# EasyEDA Pro project ProPrj_FK407M3-VET6-V1.1-LCD-EB_2024-11-07.epro

# Schematic Schematic1
Board Name: Board1; Create Date: 2024-10-30; Page Name: P1; Project Name: FK407M3-VET6-V1.1-LCD-EB; Schematic Name: Schematic1; Update Date: 2024-10-31; Company: 华北理工大学; Drawed: nayo; Page Size: A4; Reviewed: nayo; Version: V1.0
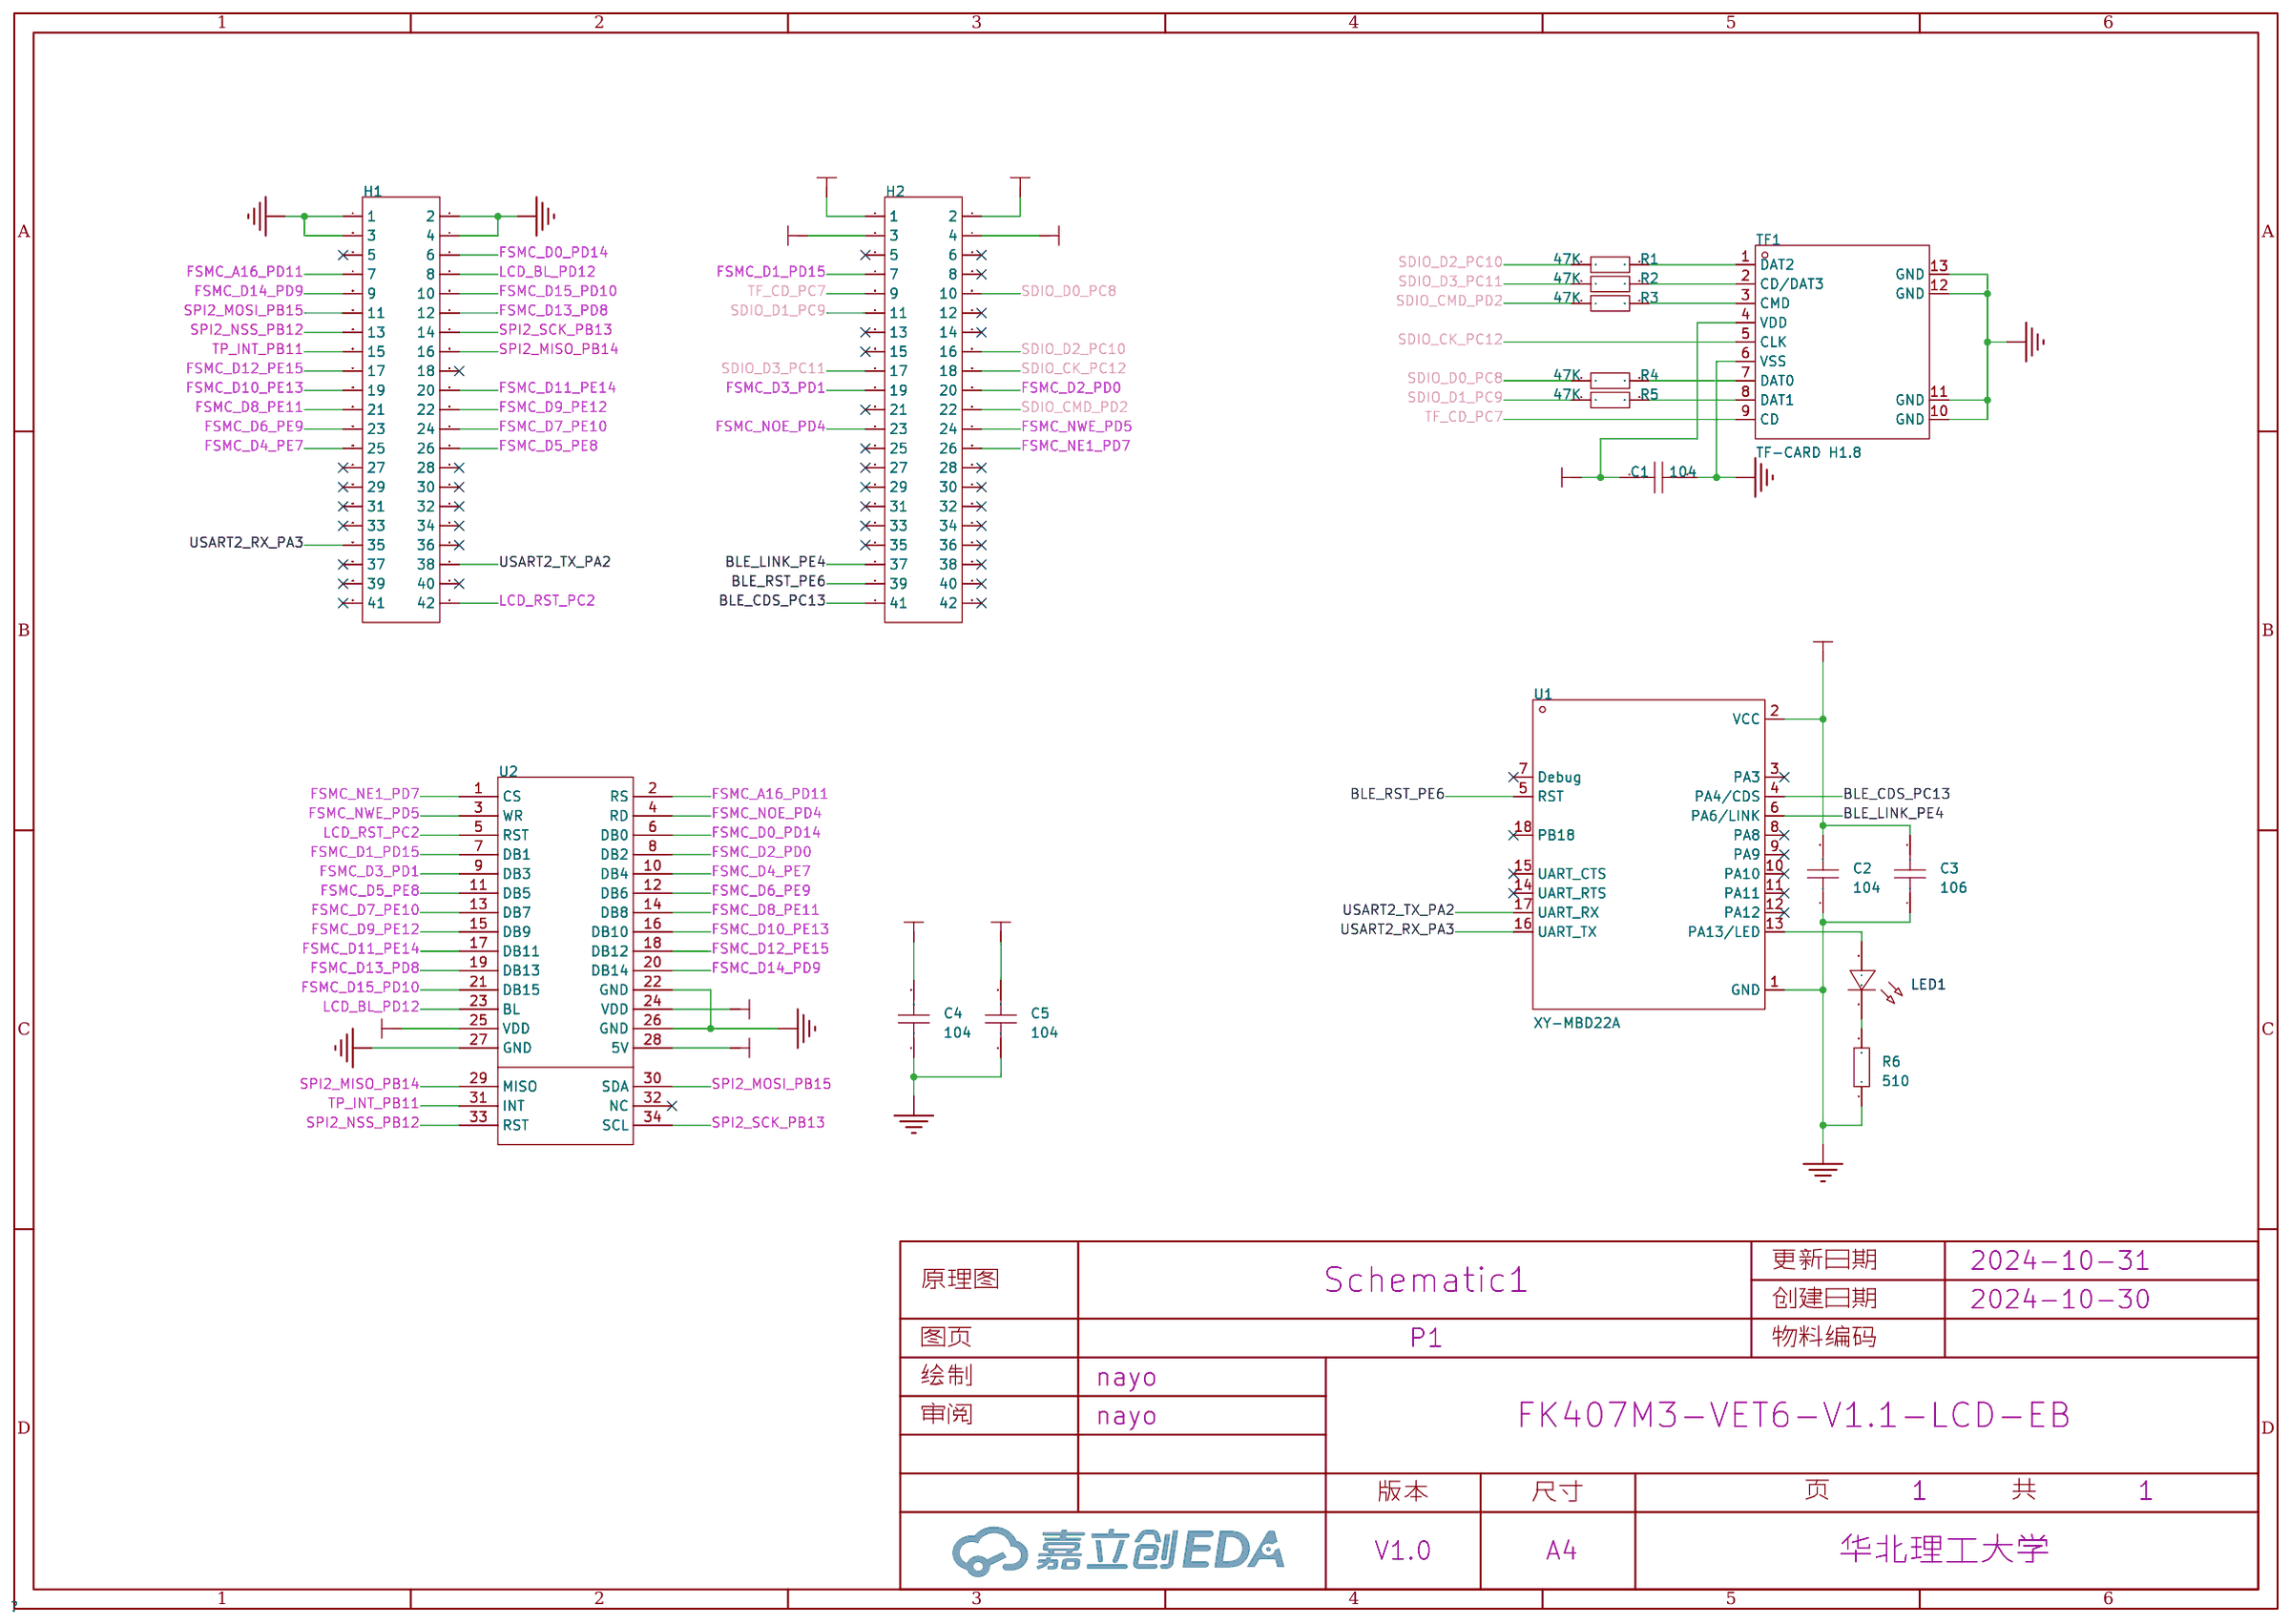
[diagram p0: schematic sheet]

## Parts
C1  104  [C0603]
C2  104  [C0603]
C3  106  [C0603]
C4  104  [C0603]
C5  104  [C0603]
H1  -  [HDR-F_2.54_2x21P]
H2  -  [HDR-F_2.54_2x21P]
LED1  -  [LED_0603]
R1  47K  [R0603]
R2  47K  [R0603]
R3  47K  [R0603]
R4  47K  [R0603]
R5  47K  [R0603]
R6  510  [R0603]
TF1  TF-CARD H1.8  [TF-SMD_TF-CARD-H1.8]
U1  XY-MBD22A  [wirelm-smd_xy-mbd22a]
U2  -  [耀元鸿3.5寸TFT液晶显示屏并口串口电阻屏5点电容屏GT911彩屏LCD-加上挖槽]

## Library data of the parts
C1-C5 = CAP_0603: Supplier Footprint: 0603
H1 H2 = HDR-F_2.54_2x21P
LED1 = LED_0603-B: Supplier Footprint: 0603
R1-R6 = Res_0603: Supplier Footprint: 0603
TF1 = TF-CARD H1.8: 卡连接方式:自弹式;卡类型:MicroSD卡(TF卡);连接器类型:卡座;本体最大高度:1.8mm;触头材质:铜合金;触头镀层:金;工作温度范围:-40℃~+70℃;; LCSC Part Name: 自弹式 MicroSD卡(TF卡) 卡座; Supplier Part: C7529389; Manufacturer: SHOU HAN(首韩); Supplier Footprint: SMD; JLCPCB Part Class: 扩展库; Datasheet: https://atta.szlcsc.com/upload/public/pdf/source/20230818/611DB5E7B45C91025B0B37F957961A64.pdf; Supplier: LCSC; Card Connection Mode: 自弹式; Card Type: MicroSD卡(TF卡); Connector Type: 卡座; Maximum Body Height: 1.8mm; Contact Material: 铜合金; Contact Plating: 金; Operating Temperature Range: -40℃~+70℃
U1 = XY-MBD22A: Supplier Part: C9900138357; Supplier Footprint: 邮票孔; Supplier: LCSC
U2 = 耀元鸿3.5寸TFT液晶显示屏并口串口电阻屏5点电容屏GT911彩屏LCD

## Nets
3V3: C1.1 C2.2 C3.2 C5.2 H2.3 H2.4 TF1.4(VDD) U1.2(VCC) U2.24(VDD) U2.25(VDD)
5V: C4.2 H2.1 H2.2 U2.28(5V)
GND: C1.2 C2.1 C3.1 C4.1 C5.1 H1.1 H1.2 H1.3 H1.4 R6.1 TF1.6(VSS) TF1.10(GND) TF1.11(GND) TF1.12(GND) TF1.13(GND) U1.1(GND) U2.22(GND) U2.26(GND) U2.27(GND)
BLE_CDS_PC13: H2.41 U1.4(PA4/CDS)
BLE_LINK_PE4: H2.37 U1.6(PA6/LINK)
BLE_RST_PE6: H2.39 U1.5(RST)
FSMC_A16_PD11: H1.7 U2.2(RS)
FSMC_D0_PD14: H1.6 U2.6(DB0)
FSMC_D1_PD15: H2.7 U2.7(DB1)
FSMC_D2_PD0: H2.20 U2.8(DB2)
FSMC_D3_PD1: H2.19 U2.9(DB3)
FSMC_D4_PE7: H1.25 U2.10(DB4)
FSMC_D5_PE8: H1.26 U2.11(DB5)
FSMC_D6_PE9: H1.23 U2.12(DB6)
FSMC_D7_PE10: H1.24 U2.13(DB7)
FSMC_D8_PE11: H1.21 U2.14(DB8)
FSMC_D9_PE12: H1.22 U2.15(DB9)
FSMC_D10_PE13: H1.19 U2.16(DB10)
FSMC_D11_PE14: H1.20 U2.17(DB11)
FSMC_D12_PE15: H1.17 U2.18(DB12)
FSMC_D13_PD8: H1.12 U2.19(DB13)
FSMC_D14_PD9: H1.9 U2.20(DB14)
FSMC_D15_PD10: H1.10 U2.21(DB15)
FSMC_NE1_PD7: H2.26 U2.1(CS)
FSMC_NOE_PD4: H2.23 U2.4(RD)
FSMC_NWE_PD5: H2.24 U2.3(WR)
LCD_BL_PD12: H1.8 U2.23(BL)
LCD_RST_PC2: H1.42 U2.5(RST)
SDIO_CK_PC12: H2.18 TF1.5(CLK)
SDIO_CMD_PD2: H2.22 R3.1
SDIO_D0_PC8: H2.10 R4.1
SDIO_D1_PC9: H2.11 R5.1
SDIO_D2_PC10: H2.16 R1.1
SDIO_D3_PC11: H2.17 R2.1
SPI2_MISO_PB14: H1.16 U2.29(MISO)
SPI2_MOSI_PB15: H1.11 U2.30(SDA)
SPI2_NSS_PB12: H1.13 U2.33(RST)
SPI2_SCK_PB13: H1.14 U2.34(SCL)
TF_CD_PC7: H2.9 TF1.9(CD)
TP_INT_PB11: H1.15 U2.31(INT)
USART2_RX_PA3: H1.35 U1.16(UART_TX)
USART2_TX_PA2: H1.38 U1.17(UART_RX)
$1N3517: R5.2 TF1.8(DAT1)
$1N3521: R4.2 TF1.7(DAT0)
$1N3530: R3.2 TF1.3(CMD)
$1N3535: R2.2 TF1.2(CD/DAT3)
$1N3540: R1.2 TF1.1(DAT2)
$1N3834: LED1.2(A) U1.13(PA13/LED)
$1N3899: LED1.1(C) R6.2

Not connected (* = marked no-connect by the designer): H1 5* 18* 27* 28* 29* 30* 31* 32* 33* 34* 36* 37* 39* 40* 41*; H2 5* 6* 8* 12* 13* 14* 15* 21* 25* 27* 28* 29* 30* 31* 32* 33* 34* 35* 36* 38* 40* 42*; U1 3(PA3)* 7(Debug)* 8(PA8)* 9(PA9)* 10(PA10)* 11(PA11)* 12(PA12)* 14(UART_RTS)* 15(UART_CTS)* 18(PB18)*; U2 32(NC)*

# Board PCB1
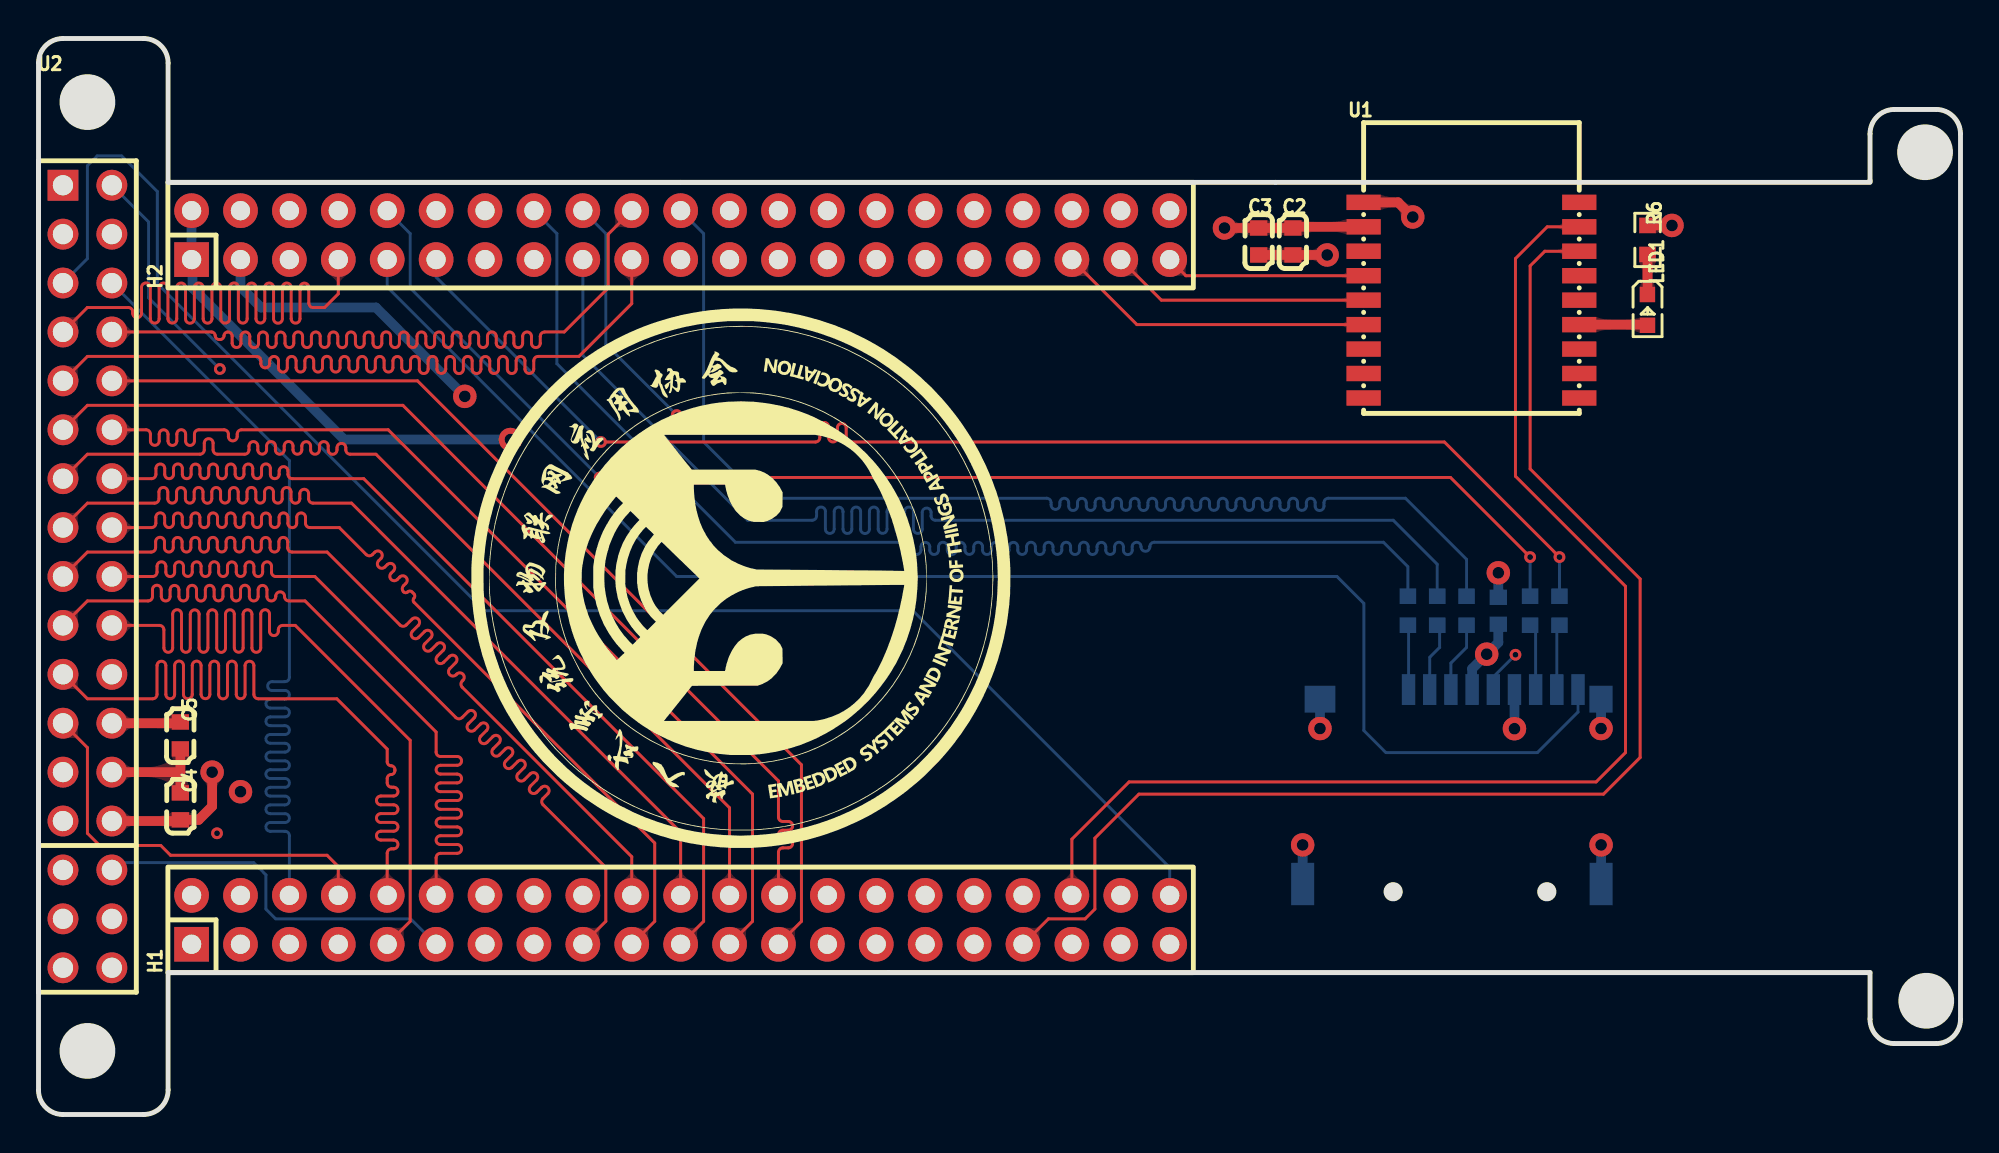
[diagram p1: board, top side]
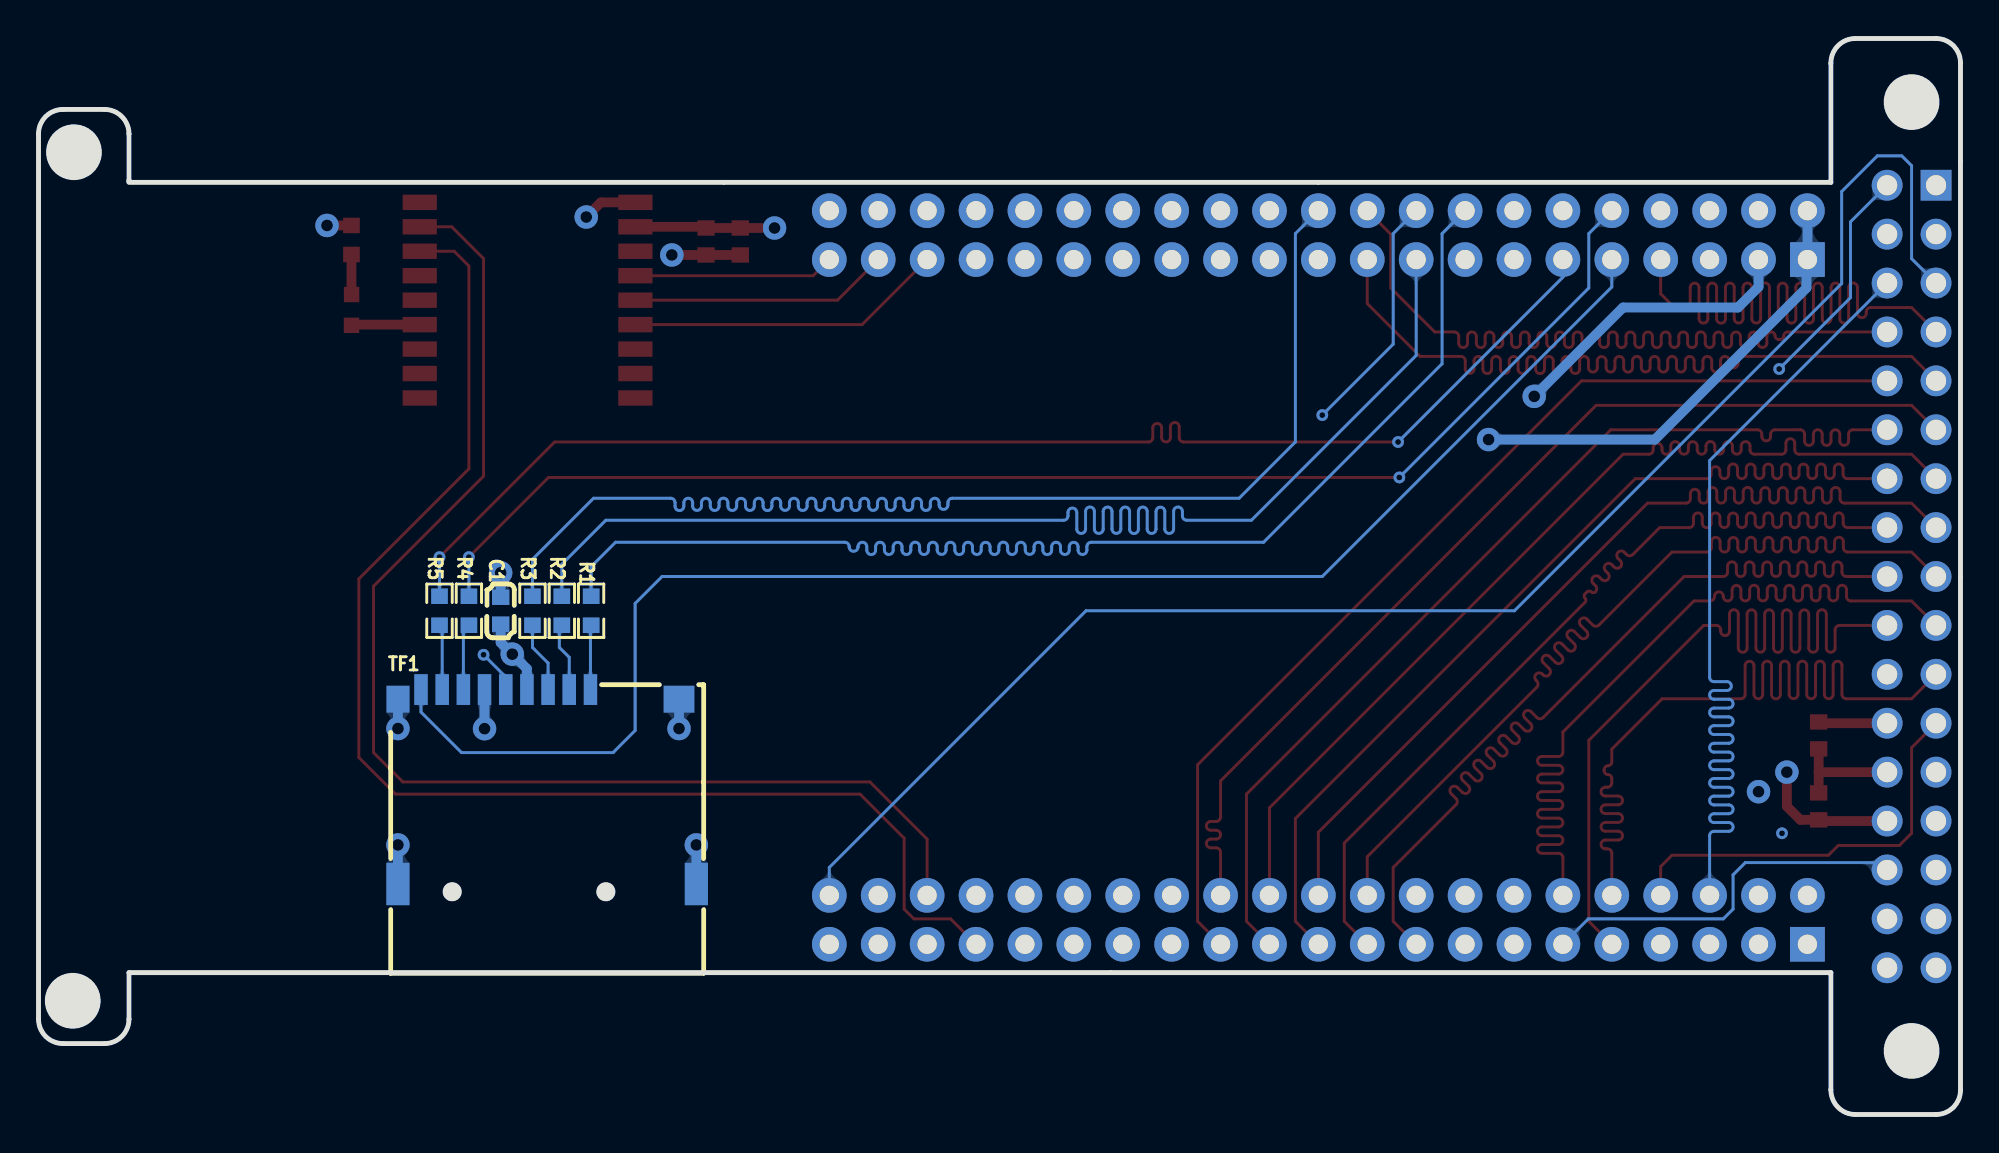
[diagram p2: board, bottom side, seen from below]

Outline 99.82 x 55.88 mm; copper layers: Top Layer, Inner1, Inner2, Bottom Layer. Coordinates in mm from the lower left corner of the outline.
Outline path: 95.12,48.51 95.12,48.46 95.12,50.93 arc(95.49,51.83) 96.39,52.2 98.55,52.2 arc(99.45,51.83) 99.82,50.93 99.82,4.95 arc(99.45,4.05) 98.55,3.68 96.39,3.68 arc(95.49,4.05) 95.12,4.95 95.12,7.37 6.73,7.37 6.73,1.27 arc(6.36,0.37) 5.46,0 1.27,0 arc(0.37,0.37) 0,1.27 0,54.61 arc(0.37,55.51) 1.27,55.88 5.46,55.88 arc(6.36,55.51) 6.73,54.61 6.73,48.41 95.12,48.41
Stack: Top Layer 0.035mm 外层铜厚1oz / Dielectric1 0.2104mm 7628 RC49% 8.6mil / Inner1 0.0152mm 内层铜厚 / Dielectric2 1.065mm 1.1mm H/HOZ Copper / Inner2 0.0152mm 内层铜厚 / Dielectric3 0.2104mm 7628 RC49% 8.6mil / Bottom Layer 0.035mm 外层铜厚1oz

## Design rules (mm)
template: 自定义配置
spacing copperThickness1oz (default): track to track 0.102, other pairs 0.152 to 0.3
spacing copperThickness2oz: track to track 0.203, other pairs 0.152 to 0.3
spacing 高速信号线: track to track 0.305, other pairs 0.152 to 0.3
track width copperThickness1oz (default): min 0.127, default 0.254, max 2.54
track width copperThickness2oz: min 0.203, default 0.254, max 2.54
differential pair differentialPair (default): width min 0.127, default 0.254, max 2.54; gap min 0.152, default 0.152
via viaSize (default): diameter min 0.5, default 0.61, max 10; hole min 0.3, default 0.305, max 6.299
net FSMC_D0_PD14 uses FSMC, 高速信号线
net FSMC_D1_PD15 uses FSMC, 高速信号线
net FSMC_D3_PD1 uses FSMC, 高速信号线
net FSMC_D2_PD0 uses FSMC, 高速信号线
net FSMC_NOE_PD4 uses FSMC, 高速信号线
net FSMC_NWE_PD5 uses FSMC, 高速信号线
net FSMC_NE1_PD7 uses FSMC, 高速信号线
net FSMC_A16_PD11 uses FSMC, 高速信号线
net FSMC_D14_PD9 uses FSMC, 高速信号线
net FSMC_D15_PD10 uses FSMC, 高速信号线
net FSMC_D13_PD8 uses FSMC, 高速信号线
net FSMC_D12_PE15 uses FSMC, 高速信号线
net FSMC_D10_PE13 uses FSMC, 高速信号线
net FSMC_D11_PE14 uses FSMC, 高速信号线
net FSMC_D8_PE11 uses FSMC, 高速信号线
net FSMC_D9_PE12 uses FSMC, 高速信号线
net FSMC_D6_PE9 uses FSMC, 高速信号线
net FSMC_D7_PE10 uses FSMC, 高速信号线
net FSMC_D4_PE7 uses FSMC, 高速信号线
net FSMC_D5_PE8 uses FSMC, 高速信号线
net SDIO_D0_PC8 uses SDIO, 高速信号线
net SDIO_D1_PC9 uses SDIO, 高速信号线
net SDIO_D2_PC10 uses SDIO, 高速信号线
net SDIO_D3_PC11 uses SDIO, 高速信号线
net SDIO_CK_PC12 uses SDIO, 高速信号线
net SDIO_CMD_PD2 uses SDIO, 高速信号线
eq len grp FSMC uses FSMC
eq len grp SDIO uses SDIO

## Placement (name value [footprint] x y rotation side)
C1  104  [C0603]  75.82 26.16 90 bottom
C2  104  [C0603]  65.15 45.34 90 top
C3  106  [C0603]  63.37 45.34 90 top
C4  104  [C0603]  7.37 16 270 top
C5  104  [C0603]  7.37 19.69 90 top
H1  -  [HDR-F_2.54_2x21P]  9.22 10.11 90 top
H2  -  [HDR-F_2.54_2x21P]  9.22 45.67 90 top
LED1  -  [LED_0603]  83.57 41.74 270 top
R1  47K  [R0603]  71.12 26.16 270 bottom
R2  47K  [R0603]  72.64 26.16 270 bottom
R3  47K  [R0603]  74.17 26.16 270 bottom
R4  47K  [R0603]  77.47 26.16 270 bottom
R5  47K  [R0603]  78.99 26.16 270 bottom
R6  510  [R0603]  83.57 45.42 270 top
TF1  TF-CARD H1.8  [TF-SMD_TF-CARD-H1.8]  73.41 17.02 180 bottom
U1  XY-MBD22A  [wirelm-smd_xy-mbd22a]  74.42 42.29 0 top
U2  -  [耀元鸿3.5寸TFT液晶显示屏并口串口电阻屏5点电容屏GT911彩屏LCD-加上挖槽]  0 49.53 0 top

## Footprints (pads in the part's own frame, mm; a bottom-side part is the same pattern mirrored in y, then rotated)
C0603
  rect 0.8x0.9 smd: 1(-0.7,0) 2(0.7,0)
HDR-F_2.54_2x21P
  rect 1.8x1.8 hole 1: 1(-1.27,1.27)
  round 1.8 hole 1: 2(1.27,1.27) 3(-1.27,-1.27) 4(1.27,-1.27) 5(-1.27,-3.811) 6(1.27,-3.811) 7(-1.27,-6.351) 8(1.27,-6.351) 9(-1.27,-8.89) 10(1.27,-8.89) 11(-1.27,-11.431) 12(1.27,-11.431) 13(-1.27,-13.97) 14(1.27,-13.97) 15(-1.27,-16.511) 16(1.27,-16.511) 17(-1.27,-19.05) 18(1.27,-19.05) 19(-1.27,-21.59) 20(1.27,-21.59) 21(-1.27,-24.131) 22(1.27,-24.131) 23(-1.27,-26.671) 24(1.27,-26.671) 25(-1.27,-29.21) 26(1.27,-29.21) 27(-1.27,-31.75) 28(1.27,-31.75) 29(-1.27,-34.291) 30(1.27,-34.291) 31(-1.27,-36.831) 32(1.27,-36.831) 33(-1.27,-39.37) 34(1.27,-39.37) 35(-1.27,-41.91) 36(1.27,-41.91) 37(-1.27,-44.45) 38(1.27,-44.45) 39(-1.27,-46.99) 40(1.27,-46.99) 41(-1.27,-49.531) 42(1.27,-49.531)
LED_0603
  rect 0.8x0.8 smd: 1(-0.851,-0.01) 2(0.75,-0.005)
R0603
  rect 0.806x0.864 smd: 1(-0.753,0) 2(0.753,0)
TF-SMD_TF-CARD-H1.8
  rect 0.7x1.6 smd: 1(2.25,5.05) 2(1.15,5.05) 3(0.05,5.05) 4(-1.05,5.05) 5(-2.15,5.05) 6(-3.25,5.05) 7(-4.35,5.05) 8(-5.45,5.05) 9(-6.55,5.05)
  rect 1.2x1.4 smd: 10(-7.747,4.55)
  rect 1.2x2.2 smd: 11(-7.75,-5.05) 12(7.75,-5.05)
  rect 1.6x1.4 smd: 13(6.85,4.55)
wirelm-smd_xy-mbd22a
  rect 1.778x0.8 smd: 1(-5.6,5.08) 2(-5.6,3.81) 3(-5.6,2.54) 4(-5.6,1.27) 5(-5.6,0) 6(-5.6,-1.27) 7(-5.6,-2.54) 8(-5.6,-3.81) 9(-5.6,-5.08) 10(5.6,-5.08) 11(5.6,-3.81) 12(5.6,-2.54) 13(5.6,-1.27) 14(5.6,0) 15(5.6,1.27) 16(5.6,2.54) 17(5.6,3.81) 18(5.6,5.08)
耀元鸿3.5寸TFT液晶显示屏并口串口电阻屏5点电容屏GT911彩屏LCD-加上挖槽
  rect 1.6x1.6 hole 1.05: 1(1.27,-1.27)
  round 1.6 hole 1.05: 2(3.81,-1.27) 3(1.27,-3.81) 4(3.81,-3.81) 5(1.27,-6.35) 6(3.81,-6.35) 7(1.27,-8.89) 8(3.81,-8.89) 9(1.27,-11.43) 10(3.81,-11.43) 11(1.27,-13.97) 12(3.81,-13.97) 13(1.27,-16.51) 14(3.81,-16.51) 15(1.27,-19.05) 16(3.81,-19.05) 17(1.27,-21.59) 18(3.81,-21.59) 19(1.27,-24.13) 20(3.81,-24.13) 21(1.27,-26.67) 22(3.81,-26.67) 23(1.27,-29.21) 24(3.81,-29.21) 25(1.27,-31.75) 26(3.81,-31.75) 27(1.27,-34.29) 28(3.81,-34.29) 29(1.27,-36.83) 30(3.81,-36.83) 31(1.27,-39.37) 32(3.81,-39.37) 33(1.27,-41.91) 34(3.81,-41.91)

## Nets
As in the schematic.

Pads without a net: H1 5 18 27 28 29 30 31 32 33 34 36 37 39 40 41; H2 5 6 8 12 13 14 15 21 25 27 28 29 30 31 32 33 34 35 36 38 40 42; U1 3 7 8 9 10 11 12 14 15 18; U2 32

## Via types
v1: diameter 1.219, hole 0.61, Top Layer to Bottom Layer, 15 vias
v2: diameter 0.61, hole 0.305, Top Layer to Bottom Layer, 8 vias

## Routing (per net, layer and track width the routed paths; a pad name or vN(x,y) marks a point on that pad's centre or on a via; arc(x,y) is an arc through that point)
3V3: length 30.2
  Top Layer w0.508: U2.24 7.3,20.32 C5.2 ; U1.2 65.21,46.1 C2.2 C3.2 v1(61.59,46.04)
  Bottom Layer w0.508: v1(22.14,37.3) 17.53,41.91 11.56,41.91 10.49,42.98 H2.3 ; C1.1 75.82,24.51 v1(75.21,23.91) 74.46,23.15 TF1.4
5V: length 61.5
  Top Layer w0.508: U2.28 7.3,15.24 C4.2 8.32,15.3 9.02,16 v1(9.02,17.78)
  Inner2 w0.508: v1(24.51,35.05) 25.91,33.66 25.91,25.15 20.57,19.81 11.05,19.81 v1(9.02,17.78)
  Bottom Layer w0.508: H2.2 H2.1 8,44.35 8,42.93 15.88,35.05 v1(24.51,35.05)
GND: length 29.3
  Top Layer w0.508: C3.1 C2.1 v1(66.93,44.64) ; R6.1 v1(84.84,46.17) ; v1(71.37,46.61) 70.61,47.37 U1.1 ; 7.37,17.8 C4.1 ; 7.37,17.8 7.34,17.78 U2.26 ; 7.37,17.8 C5.1
  Inner1 w0.508: H1.4 v1(10.49,16.76)
  Bottom Layer w0.508: C1.2 v1(75.82,28.13) ; TF1.13 v1(66.56,20.04) ; TF1.12 v1(65.66,14) ; TF1.10 v1(81.15,20.04) ; TF1.11 v1(81.16,14) ; TF1.6 v1(76.66,20.04)
BLE_CDS_PC13: length 10.4
  Top Layer w0.152: U1.4 59.59,43.56 H2.41
BLE_LINK_PE4: length 16.6
  Top Layer w0.152: H2.37 57.05,41.02 U1.6
BLE_RST_PE6: length 13.5
  Top Layer w0.152: H2.39 58.32,42.29 U1.5
FSMC_A16_PD11: length 53.9
  Inner1 w0.152: v2(9.42,38.72) 16.76,31.37 16.76,25.49 arc(16.7,25.32) 16.54,25.26 16.45,25.26 arc(16.22,25.03) 16.45,24.8 16.54,24.8 arc(16.76,24.57) 16.54,24.34 16.36,24.34 arc(16.13,24.11) 16.36,23.89 16.54,23.89 arc(16.76,23.66) 16.54,23.43 16.36,23.43 arc(16.13,23.2) 16.36,22.97 16.54,22.97 arc(16.76,22.74) 16.54,22.51 16.36,22.51 arc(16.13,22.29) 16.36,22.06 16.54,22.06 arc(16.76,21.83) 16.54,21.6 16.36,21.6 arc(16.13,21.37) 16.36,21.14 16.54,21.14 arc(16.76,20.91) 16.54,20.69 16.36,20.69 arc(16.13,20.46) 16.36,20.23 16.54,20.23 arc(16.76,20) 16.54,19.77 16.36,19.77 arc(16.13,19.54) 16.36,19.31 16.54,19.31 arc(16.76,19.09) 16.54,18.86 16.36,18.86 arc(16.13,18.63) 16.36,18.4 16.54,18.4 arc(16.76,18.17) 16.54,17.94 16.36,17.94 arc(16.13,17.71) 16.36,17.49 16.54,17.49 arc(16.76,17.26) 16.54,17.03 16.36,17.03 arc(16.13,16.8) 16.36,16.57 16.54,16.57 arc(16.7,16.5) 16.76,16.34 16.76,10.03 H1.7
  Bottom Layer w0.152: U2.2 5.71,46.36 5.71,42.42 v2(9.42,38.72)
FSMC_D0_PD14: length 53.9
  Bottom Layer w0.152: H1.6 13.03,14.48 arc(12.96,14.64) 12.8,14.71 12.04,14.71 arc(11.81,14.94) 12.04,15.16 12.8,15.16 arc(13.03,15.39) 12.8,15.62 12.04,15.62 arc(11.81,15.85) 12.04,16.08 12.8,16.08 arc(13.03,16.31) 12.8,16.54 12.04,16.54 arc(11.81,16.76) 12.04,16.99 12.8,16.99 arc(13.03,17.22) 12.8,17.45 12.04,17.45 arc(11.81,17.68) 12.04,17.91 12.8,17.91 arc(13.03,18.14) 12.8,18.36 12.04,18.36 arc(11.81,18.59) 12.04,18.82 12.8,18.82 arc(13.03,19.05) 12.8,19.28 12.04,19.28 arc(11.81,19.51) 12.04,19.74 12.8,19.74 arc(13.03,19.96) 12.8,20.19 12.04,20.19 arc(11.81,20.42) 12.04,20.65 12.8,20.65 arc(13.03,20.88) 12.8,21.11 12.04,21.11 arc(11.81,21.34) 12.04,21.56 12.8,21.56 arc(13.03,21.79) 12.8,22.02 12.13,22.02 arc(11.9,22.25) 12.13,22.48 12.8,22.48 arc(12.96,22.55) 13.03,22.71 13.03,33.96 U2.6
FSMC_D1_PD15: length 53.9
  Top Layer w0.152: U2.7 2.54,41.91 4.66,41.91 arc(4.83,41.84) 4.89,41.68 4.89,41.61 arc(5.12,41.38) 5.35,41.61 5.35,42.95 arc(5.58,43.18) 5.81,42.95 5.81,41.33 arc(6.04,41.1) 6.27,41.33 6.27,42.95 arc(6.49,43.18) 6.72,42.95 6.72,41.33 arc(6.95,41.1) 7.18,41.33 7.18,42.95 arc(7.41,43.18) 7.64,42.95 7.64,41.33 arc(7.86,41.1) 8.09,41.33 8.09,42.95 arc(8.32,43.18) 8.55,42.95 8.55,41.33 arc(8.78,41.1) 9.01,41.33 9.01,42.95 arc(9.24,43.18) 9.47,42.95 9.47,41.33 arc(9.69,41.1) 9.92,41.33 9.92,42.95 arc(10.15,43.18) 10.38,42.95 10.38,41.33 arc(10.61,41.1) 10.84,41.33 10.84,42.95 arc(11.07,43.18) 11.29,42.95 11.29,41.33 arc(11.52,41.1) 11.75,41.33 11.75,42.95 arc(11.98,43.18) 12.21,42.95 12.21,41.33 arc(12.44,41.1) 12.67,41.33 12.67,42.95 arc(12.89,43.18) 13.12,42.95 13.12,41.33 arc(13.35,41.1) 13.58,41.33 13.58,42.95 arc(13.81,43.18) 14.04,42.95 14.04,42.14 arc(14.1,41.98) 14.27,41.91 14.86,41.91 15.57,42.62 H2.7
FSMC_D2_PD0: length 53.9
  Top Layer w0.152: U2.8 8.98,40.64 arc(9.12,40.58) 9.18,40.45 arc(9.23,40.31) 9.37,40.25 9.44,40.25 arc(9.58,40.31) 9.63,40.45 arc(9.69,40.58) 9.83,40.64 arc(9.99,40.57) 10.06,40.41 10.06,40.06 arc(10.29,39.83) 10.52,40.06 10.52,40.41 arc(10.74,40.64) 10.97,40.41 10.97,40.06 arc(11.2,39.83) 11.43,40.06 11.43,40.41 arc(11.66,40.64) 11.89,40.41 11.89,40.06 arc(12.11,39.83) 12.34,40.06 12.34,40.41 arc(12.57,40.64) 12.8,40.41 12.8,40.06 arc(13.03,39.83) 13.26,40.06 13.26,40.41 arc(13.49,40.64) 13.72,40.41 13.72,40.06 arc(13.94,39.83) 14.17,40.06 14.17,40.41 arc(14.4,40.64) 14.63,40.41 14.63,40.06 arc(14.86,39.83) 15.09,40.06 15.09,40.41 arc(15.32,40.64) 15.54,40.41 15.54,40.06 arc(15.77,39.83) 16,40.06 16,40.41 arc(16.23,40.64) 16.46,40.41 16.46,40.06 arc(16.69,39.83) 16.92,40.06 16.92,40.41 arc(17.14,40.64) 17.37,40.41 17.37,40.06 arc(17.6,39.83) 17.83,40.06 17.83,40.41 arc(18.06,40.64) 18.29,40.41 18.29,40.06 arc(18.52,39.83) 18.74,40.06 18.74,40.41 arc(18.97,40.64) 19.2,40.41 19.2,40.06 arc(19.43,39.83) 19.66,40.06 19.66,40.41 arc(19.89,40.64) 20.12,40.41 20.12,40.06 arc(20.34,39.83) 20.57,40.06 20.57,40.41 arc(20.8,40.64) 21.03,40.41 21.03,40.06 arc(21.26,39.83) 21.49,40.06 21.49,40.41 arc(21.72,40.64) 21.94,40.41 21.94,40.06 arc(22.17,39.83) 22.4,40.06 22.4,40.41 arc(22.63,40.64) 22.86,40.41 22.86,40.06 arc(23.09,39.83) 23.32,40.06 23.32,40.41 arc(23.55,40.64) 23.77,40.41 23.77,40.06 arc(24,39.83) 24.23,40.06 24.23,40.41 arc(24.46,40.64) 24.69,40.41 24.69,40.06 arc(24.92,39.83) 25.15,40.06 25.15,40.41 arc(25.37,40.64) 25.6,40.41 25.6,40.06 arc(25.83,39.83) 26.06,40.06 26.06,40.41 arc(26.13,40.57) 26.29,40.64 27.3,40.64 29.59,42.93 29.59,45.72 H2.20
FSMC_D3_PD1: length 53.9
  Top Layer w0.152: U2.9 2.54,39.37 11.32,39.37 arc(11.48,39.3) 11.55,39.14 11.55,39 arc(11.78,38.77) 12.01,39 12.01,39.14 arc(12.23,39.37) 12.46,39.14 12.46,38.79 arc(12.69,38.56) 12.92,38.79 12.92,39.14 arc(13.15,39.37) 13.38,39.14 13.38,38.79 arc(13.61,38.56) 13.83,38.79 13.83,39.14 arc(14.06,39.37) 14.29,39.14 14.29,38.79 arc(14.52,38.56) 14.75,38.79 14.75,39.14 arc(14.98,39.37) 15.21,39.14 15.21,38.79 arc(15.44,38.56) 15.66,38.79 15.66,39.14 arc(15.89,39.37) 16.12,39.14 16.12,38.79 arc(16.35,38.56) 16.58,38.79 16.58,39.14 arc(16.81,39.37) 17.03,39.14 17.03,38.79 arc(17.26,38.56) 17.49,38.79 17.49,39.14 arc(17.72,39.37) 17.95,39.14 17.95,38.79 arc(18.18,38.56) 18.41,38.79 18.41,39.14 arc(18.64,39.37) 18.86,39.14 18.86,38.79 arc(19.09,38.56) 19.32,38.79 19.32,39.14 arc(19.55,39.37) 19.78,39.14 19.78,38.71 arc(20.01,38.48) 20.24,38.71 20.24,39.14 arc(20.46,39.37) 20.69,39.14 20.69,38.71 arc(20.92,38.48) 21.15,38.71 21.15,39.14 arc(21.38,39.37) 21.61,39.14 21.61,38.71 arc(21.84,38.48) 22.06,38.71 22.06,39.14 arc(22.29,39.37) 22.52,39.14 22.52,38.71 arc(22.75,38.48) 22.98,38.71 22.98,39.14 arc(23.21,39.37) 23.44,39.14 23.44,38.71 arc(23.66,38.48) 23.89,38.71 23.89,39.14 arc(24.12,39.37) 24.35,39.14 24.35,38.71 arc(24.58,38.48) 24.81,38.71 24.81,39.14 arc(25.04,39.37) 25.26,39.14 25.26,38.71 arc(25.49,38.48) 25.72,38.71 25.72,39.14 arc(25.79,39.3) 25.95,39.37 28.07,39.37 30.81,42.11 H2.19
FSMC_D4_PE7: length 53.9
  Top Layer w0.152: U2.10 19.69,38.1 39.62,18.16 39.62,10.03 H1.25
FSMC_D5_PE8: length 53.9
  Top Layer w0.152: U2.11 2.54,36.83 18.92,36.83 38.43,17.32 38.43,15.45 arc(38.5,15.29) 38.66,15.22 38.94,15.22 arc(39.17,14.99) 38.94,14.76 38.66,14.76 arc(38.43,14.53) 38.66,14.3 38.94,14.3 arc(39.17,14.08) 38.94,13.85 38.66,13.85 arc(38.5,13.78) 38.43,13.62 H1.26
FSMC_D6_PE9: length 53.9
  Top Layer w0.152: U2.12 5.58,35.56 arc(5.75,35.49) 5.81,35.33 5.81,34.98 arc(6.04,34.75) 6.27,34.98 6.27,35.33 arc(6.5,35.56) 6.73,35.33 6.73,34.98 arc(6.95,34.75) 7.18,34.98 7.18,35.33 arc(7.41,35.56) 7.64,35.33 7.64,34.98 arc(7.87,34.75) 8.1,34.98 8.1,35.33 arc(8.16,35.49) 8.33,35.56 9.63,35.56 arc(9.79,35.49) 9.86,35.33 9.86,35.21 arc(10.09,34.98) 10.32,35.21 10.32,35.33 arc(10.39,35.49) 10.55,35.56 18.16,35.56 37.08,16.64 37.08,10.03 H1.23
FSMC_D7_PE10: length 53.9
  Top Layer w0.152: H1.24 35.89,15.93 17.53,34.29 16.19,34.29 arc(16.03,34.36) 15.96,34.52 15.96,34.63 arc(15.73,34.86) 15.5,34.63 15.5,34.52 arc(15.27,34.29) 15.05,34.52 15.05,34.72 arc(14.82,34.95) 14.59,34.72 14.59,34.52 arc(14.36,34.29) 14.13,34.52 14.13,34.72 arc(13.9,34.95) 13.67,34.72 13.67,34.52 arc(13.45,34.29) 13.22,34.52 13.22,34.72 arc(12.99,34.95) 12.76,34.72 12.76,34.52 arc(12.53,34.29) 12.3,34.52 12.3,34.72 arc(12.07,34.95) 11.85,34.72 11.85,34.52 arc(11.62,34.29) 11.39,34.52 11.39,34.72 arc(11.16,34.95) 10.93,34.72 10.93,34.52 arc(10.86,34.36) 10.7,34.29 9.3,34.29 arc(9.13,34.36) 9.07,34.52 9.07,34.87 arc(8.84,35.1) 8.61,34.87 8.61,34.52 arc(8.54,34.36) 8.38,34.29 2.54,34.29 U2.13
FSMC_D8_PE11: length 53.9
  Top Layer w0.152: U2.14 5.87,33.02 arc(6.03,33.09) 6.1,33.25 6.1,33.55 arc(6.33,33.78) 6.55,33.55 6.55,33.25 arc(6.78,33.02) 7.01,33.25 7.01,33.55 arc(7.24,33.78) 7.47,33.55 7.47,33.25 arc(7.7,33.02) 7.93,33.25 7.93,33.55 arc(8.16,33.78) 8.38,33.55 8.38,33.25 arc(8.61,33.02) 8.84,33.25 8.84,33.55 arc(9.07,33.78) 9.3,33.55 9.3,33.25 arc(9.53,33.02) 9.76,33.25 9.76,33.55 arc(9.98,33.78) 10.21,33.55 10.21,33.25 arc(10.44,33.02) 10.67,33.25 10.67,33.55 arc(10.9,33.78) 11.13,33.55 11.13,33.25 arc(11.36,33.02) 11.58,33.25 11.58,33.55 arc(11.81,33.78) 12.04,33.55 12.04,33.25 arc(12.27,33.02) 12.5,33.25 12.5,33.42 arc(12.73,33.65) 12.96,33.42 12.96,33.25 arc(13.02,33.09) 13.18,33.02 16.89,33.02 34.54,15.37 34.54,10.03 H1.21
FSMC_D9_PE12: length 53.9
  Top Layer w0.152: H1.22 33.35,14.66 16.26,31.75 14.26,31.75 arc(14.1,31.82) 14.03,31.98 14.03,32.24 arc(13.8,32.47) 13.57,32.24 13.57,31.98 arc(13.34,31.75) 13.11,31.98 13.11,32.33 arc(12.89,32.56) 12.66,32.33 12.66,31.98 arc(12.43,31.75) 12.2,31.98 12.2,32.33 arc(11.97,32.56) 11.74,32.33 11.74,31.98 arc(11.51,31.75) 11.29,31.98 11.29,32.33 arc(11.06,32.56) 10.83,32.33 10.83,31.98 arc(10.6,31.75) 10.37,31.98 10.37,32.33 arc(10.14,32.56) 9.91,32.33 9.91,31.98 arc(9.69,31.75) 9.46,31.98 9.46,32.33 arc(9.23,32.56) 9,32.33 9,31.98 arc(8.77,31.75) 8.54,31.98 8.54,32.33 arc(8.31,32.56) 8.08,32.33 8.08,31.98 arc(7.86,31.75) 7.63,31.98 7.63,32.33 arc(7.4,32.56) 7.17,32.33 7.17,31.98 arc(6.94,31.75) 6.71,31.98 6.71,32.33 arc(6.48,32.56) 6.26,32.33 6.26,31.98 arc(6.19,31.82) 6.03,31.75 2.54,31.75 U2.15
FSMC_D10_PE13: length 53.9
  Top Layer w0.152: U2.16 5.87,30.48 arc(6.03,30.55) 6.09,30.71 6.09,31.01 arc(6.32,31.24) 6.55,31.01 6.55,30.71 arc(6.78,30.48) 7.01,30.71 7.01,31.01 arc(7.24,31.24) 7.47,31.01 7.47,30.71 arc(7.69,30.48) 7.92,30.71 7.92,31.01 arc(8.15,31.24) 8.38,31.01 8.38,30.71 arc(8.61,30.48) 8.84,30.71 8.84,31.01 arc(9.07,31.24) 9.3,31.01 9.3,30.71 arc(9.52,30.48) 9.75,30.71 9.75,31.01 arc(9.98,31.24) 10.21,31.01 10.21,30.71 arc(10.44,30.48) 10.67,30.71 10.67,31.01 arc(10.9,31.24) 11.12,31.01 11.12,30.71 arc(11.35,30.48) 11.58,30.71 11.58,31.01 arc(11.81,31.24) 12.04,31.01 12.04,30.71 arc(12.27,30.48) 12.5,30.71 12.5,31.01 arc(12.72,31.24) 12.95,31.01 12.95,30.71 arc(13.18,30.48) 13.41,30.71 13.41,31.01 arc(13.64,31.24) 13.87,31.01 13.87,30.71 arc(13.93,30.55) 14.1,30.48 15.62,30.48 17.02,29.08 arc(17.18,29.01) 17.34,29.08 17.46,29.2 arc(17.79,29.2) 17.79,28.88 17.67,28.76 arc(17.67,28.43) 17.99,28.43 18.11,28.56 arc(18.43,28.56) 18.43,28.23 18.31,28.11 arc(18.31,27.79) 18.64,27.79 18.76,27.91 arc(19.08,27.91) 19.08,27.59 18.96,27.46 arc(18.89,27.3) 18.96,27.14 arc(19.07,27.1) 19.18,27.14 arc(19.29,27.19) 19.4,27.14 19.5,27.04 arc(19.55,26.93) 19.5,26.82 arc(19.46,26.71) 19.5,26.6 32,14.1 32,10.03 H1.19
FSMC_D11_PE14: length 53.9
  Top Layer w0.152: H1.20 30.81,13.39 22.01,22.19 arc(21.94,22.35) 22.01,22.51 22.04,22.55 arc(22.04,22.87) 21.72,22.87 21.68,22.84 arc(21.36,22.83) 21.36,23.16 21.67,23.46 arc(21.67,23.79) 21.34,23.79 21.04,23.48 arc(20.71,23.48) 20.71,23.8 21.02,24.11 arc(21.02,24.43) 20.7,24.43 20.39,24.13 arc(20.07,24.13) 20.07,24.45 20.37,24.76 arc(20.37,25.08) 20.05,25.08 19.74,24.77 arc(19.42,24.77) 19.42,25.1 19.73,25.4 arc(19.73,25.73) 19.4,25.73 19.1,25.42 arc(18.94,25.35) 18.77,25.42 14.99,29.21 13.17,29.21 arc(13.01,29.28) 12.94,29.44 12.94,29.74 arc(12.71,29.97) 12.48,29.74 12.48,29.44 arc(12.26,29.21) 12.03,29.44 12.03,29.74 arc(11.8,29.97) 11.57,29.74 11.57,29.44 arc(11.34,29.21) 11.11,29.44 11.11,29.74 arc(10.88,29.97) 10.66,29.74 10.66,29.44 arc(10.43,29.21) 10.2,29.44 10.2,29.74 arc(9.97,29.97) 9.74,29.74 9.74,29.44 arc(9.51,29.21) 9.28,29.44 9.28,29.74 arc(9.06,29.97) 8.83,29.74 8.83,29.44 arc(8.6,29.21) 8.37,29.44 8.37,29.74 arc(8.14,29.97) 7.91,29.74 7.91,29.44 arc(7.68,29.21) 7.46,29.44 7.46,29.74 arc(7.23,29.97) 7,29.74 7,29.44 arc(6.77,29.21) 6.54,29.44 6.54,29.74 arc(6.31,29.97) 6.08,29.74 6.08,29.44 arc(6.02,29.28) 5.85,29.21 2.54,29.21 U2.17
FSMC_D12_PE15: length 53.9
  Top Layer w0.152: H1.17 29.46,10.03 29.46,12.83 26.2,16.09 arc(26.14,16.25) 26.2,16.41 26.45,16.66 arc(26.45,16.98) 26.13,16.98 25.88,16.74 arc(25.56,16.74) 25.56,17.06 25.86,17.36 arc(25.86,17.69) 25.54,17.69 25.23,17.38 arc(24.91,17.38) 24.91,17.71 25.21,18.01 arc(25.22,18.33) 24.89,18.33 24.59,18.03 arc(24.26,18.03) 24.26,18.35 24.57,18.66 arc(24.57,18.98) 24.24,18.98 23.94,18.68 arc(23.62,18.67) 23.62,19 23.92,19.3 arc(23.92,19.63) 23.6,19.63 23.29,19.32 arc(22.97,19.32) 22.97,19.65 23.28,19.95 arc(23.27,20.27) 22.95,20.27 22.65,19.97 arc(22.32,19.97) 22.32,20.29 22.63,20.6 arc(22.63,20.92) 22.31,20.92 22,20.62 arc(21.84,20.55) 21.68,20.62 14.35,27.94 12.33,27.94 arc(12.17,28.01) 12.1,28.17 12.1,28.47 arc(11.87,28.7) 11.64,28.47 11.64,28.17 arc(11.41,27.94) 11.19,28.17 11.19,28.47 arc(10.96,28.7) 10.73,28.47 10.73,28.17 arc(10.5,27.94) 10.27,28.17 10.27,28.47 arc(10.04,28.7) 9.81,28.47 9.81,28.17 arc(9.58,27.94) 9.36,28.17 9.36,28.47 arc(9.13,28.7) 8.9,28.47 8.9,28.17 arc(8.67,27.94) 8.44,28.17 8.44,28.47 arc(8.21,28.7) 7.98,28.47 7.98,28.17 arc(7.76,27.94) 7.53,28.17 7.53,28.47 arc(7.3,28.7) 7.07,28.47 7.07,28.17 arc(6.84,27.94) 6.61,28.17 6.61,28.47 arc(6.38,28.7) 6.16,28.47 6.16,28.17 arc(6.09,28.01) 5.93,27.94 U2.18
FSMC_D13_PD8: length 53.9
  Top Layer w0.152: U2.19 2.54,26.67 5.69,26.67 arc(5.85,26.74) 5.92,26.9 5.92,27.25 arc(6.15,27.48) 6.38,27.25 6.38,26.9 arc(6.61,26.67) 6.83,26.9 6.83,27.25 arc(7.06,27.48) 7.29,27.25 7.29,26.9 arc(7.52,26.67) 7.75,26.9 7.75,27.25 arc(7.98,27.48) 8.21,27.25 8.21,26.9 arc(8.44,26.67) 8.66,26.9 8.66,27.25 arc(8.89,27.48) 9.12,27.25 9.12,26.9 arc(9.35,26.67) 9.58,26.9 9.58,27.25 arc(9.81,27.48) 10.03,27.25 10.03,26.9 arc(10.26,26.67) 10.49,26.9 10.49,27.25 arc(10.72,27.48) 10.95,27.25 10.95,26.9 arc(11.18,26.67) 11.41,26.9 11.41,27.25 arc(11.63,27.48) 11.86,27.25 11.86,26.9 arc(12.09,26.67) 12.32,26.9 12.32,26.91 arc(12.55,27.14) 12.78,26.91 12.78,26.9 arc(12.85,26.74) 13.01,26.67 13.84,26.67 20.65,19.86 20.65,18.82 arc(20.72,18.66) 20.88,18.59 21.74,18.59 arc(21.97,18.36) 21.74,18.14 20.88,18.14 arc(20.65,17.91) 20.88,17.68 21.74,17.68 arc(21.97,17.45) 21.74,17.22 20.88,17.22 arc(20.65,16.99) 20.88,16.76 21.74,16.76 arc(21.97,16.54) 21.74,16.31 20.88,16.31 arc(20.65,16.08) 20.88,15.85 21.74,15.85 arc(21.97,15.62) 21.74,15.39 20.88,15.39 arc(20.65,15.16) 20.88,14.94 21.74,14.94 arc(21.97,14.71) 21.74,14.48 20.88,14.48 arc(20.65,14.25) 20.88,14.02 21.74,14.02 arc(21.97,13.79) 21.74,13.56 20.88,13.56 arc(20.72,13.5) 20.65,13.34 H1.12
FSMC_D14_PD9: length 53.9
  Top Layer w0.152: H1.9 19.3,10.03 19.3,19.43 13.33,25.4 12.68,25.4 arc(12.52,25.33) 12.45,25.17 12.45,25.1 arc(12.23,24.87) 12,25.1 12,25.98 arc(11.77,26.21) 11.54,25.98 11.54,24.23 arc(11.31,24) 11.08,24.23 11.08,25.98 arc(10.85,26.21) 10.63,25.98 10.63,24.23 arc(10.4,24) 10.17,24.23 10.17,25.98 arc(9.94,26.21) 9.71,25.98 9.71,24.23 arc(9.48,24) 9.25,24.23 9.25,25.98 arc(9.03,26.21) 8.8,25.98 8.8,24.23 arc(8.57,24) 8.34,24.23 8.34,25.98 arc(8.11,26.21) 7.88,25.98 7.88,24.23 arc(7.65,24) 7.43,24.23 7.43,25.98 arc(7.2,26.21) 6.97,25.98 6.97,24.23 arc(6.74,24) 6.51,24.23 6.51,25.17 arc(6.44,25.33) 6.28,25.4 U2.20
FSMC_D15_PD10: length 53.9
  Top Layer w0.152: H1.10 18.11,13.57 arc(18.18,13.73) 18.34,13.8 18.44,13.8 arc(18.67,14.03) 18.44,14.25 17.78,14.25 arc(17.55,14.48) 17.78,14.71 18.44,14.71 arc(18.67,14.94) 18.44,15.17 17.78,15.17 arc(17.55,15.4) 17.78,15.63 18.44,15.63 arc(18.67,15.85) 18.44,16.08 17.78,16.08 arc(17.55,16.31) 17.78,16.54 18.44,16.54 arc(18.67,16.77) 18.44,17 18.34,17 arc(18.18,17.06) 18.11,17.23 18.11,17.45 arc(18.17,17.6) 18.31,17.65 arc(18.45,17.71) 18.51,17.85 18.51,17.91 arc(18.45,18.05) 18.31,18.11 arc(18.17,18.17) 18.11,18.31 18.11,18.97 15.49,21.59 11.41,21.59 arc(11.25,21.66) 11.19,21.82 11.19,23.32 arc(10.96,23.54) 10.73,23.32 10.73,21.82 arc(10.5,21.59) 10.27,21.82 10.27,23.32 arc(10.04,23.54) 9.81,23.32 9.81,21.82 arc(9.58,21.59) 9.36,21.82 9.36,23.32 arc(9.13,23.54) 8.9,23.32 8.9,21.82 arc(8.67,21.59) 8.44,21.82 8.44,23.32 arc(8.21,23.54) 7.98,23.32 7.98,21.82 arc(7.76,21.59) 7.53,21.82 7.53,23.32 arc(7.3,23.55) 7.07,23.32 7.07,21.82 arc(6.84,21.59) 6.61,21.82 6.61,23.32 arc(6.38,23.54) 6.16,23.32 6.16,21.82 arc(6.09,21.66) 5.93,21.59 2.54,21.59 U2.21
FSMC_NE1_PD7: length 53.9
  Inner1 w0.152: H2.26 37.08,45.59 37.08,42.93 34.16,40.01 30.39,40.01 arc(30.23,39.94) 30.16,39.78 30.16,39.09 arc(29.93,38.86) 29.71,39.09 29.71,39.78 arc(29.48,40.01) 29.25,39.78 29.25,39.09 arc(29.02,38.86) 28.79,39.09 28.79,39.78 arc(28.56,40.01) 28.33,39.78 28.33,39.09 arc(28.11,38.86) 27.88,39.09 27.88,39.78 arc(27.65,40.01) 27.42,39.78 27.42,39.12 arc(27.19,38.89) 26.96,39.12 26.96,39.78 arc(26.9,39.94) 26.73,40.01 8.88,40.01 4.43,44.45 3.05,44.45 2.54,44.96 2.54,47.24 1.52,48.26 U2.1
FSMC_NOE_PD4: length 53.9
  Inner1 w0.152: U2.4 8.25,41.28 16.83,41.28 arc(17,41.34) 17.06,41.5 17.06,41.94 arc(17.29,42.16) 17.52,41.94 17.52,41.5 arc(17.75,41.28) 17.98,41.5 17.98,42.06 arc(18.21,42.29) 18.43,42.06 18.43,41.5 arc(18.66,41.28) 18.89,41.5 18.89,42.06 arc(19.12,42.29) 19.35,42.06 19.35,41.5 arc(19.58,41.28) 19.81,41.5 19.81,42.06 arc(20.03,42.29) 20.26,42.06 20.26,41.5 arc(20.49,41.28) 20.72,41.5 20.72,42.06 arc(20.95,42.29) 21.18,42.06 21.18,41.5 arc(21.41,41.27) 21.63,41.5 21.63,42.06 arc(21.86,42.29) 22.09,42.06 22.09,41.5 arc(22.32,41.28) 22.55,41.5 22.55,42.06 arc(22.78,42.29) 23.01,42.06 23.01,41.5 arc(23.23,41.28) 23.46,41.5 23.46,42.06 arc(23.69,42.29) 23.92,42.06 23.92,41.5 arc(24.15,41.28) 24.38,41.5 24.38,42.06 arc(24.61,42.29) 24.83,42.06 24.83,41.5 arc(25.06,41.28) 25.29,41.5 25.29,42.06 arc(25.52,42.29) 25.75,42.06 25.75,41.5 arc(25.98,41.27) 26.21,41.5 26.21,42.06 arc(26.44,42.29) 26.66,42.06 26.66,41.5 arc(26.73,41.34) 26.89,41.28 34.24,41.28 35.89,42.93 H2.23
FSMC_NWE_PD5: length 53.9
  Inner2 w0.152: U2.3 2.54,44.45 4.7,44.45 5.59,43.56 5.59,42.04 6.35,41.28 15.42,41.28 arc(15.58,41.34) 15.65,41.5 15.65,42.06 arc(15.88,42.29) 16.11,42.06 16.11,41.5 arc(16.34,41.28) 16.56,41.5 16.56,42.06 arc(16.79,42.29) 17.02,42.06 17.02,41.5 arc(17.25,41.28) 17.48,41.5 17.48,42.06 arc(17.71,42.29) 17.94,42.06 17.94,41.5 arc(18.16,41.28) 18.39,41.5 18.39,42.06 arc(18.62,42.29) 18.85,42.06 18.85,41.5 arc(19.08,41.27) 19.31,41.5 19.31,42.06 arc(19.54,42.29) 19.76,42.06 19.76,41.5 arc(19.99,41.28) 20.22,41.5 20.22,42.06 arc(20.45,42.29) 20.68,42.06 20.68,41.5 arc(20.91,41.28) 21.14,41.5 21.14,42.06 arc(21.36,42.29) 21.59,42.06 21.59,41.5 arc(21.82,41.28) 22.05,41.5 22.05,41.8 arc(22.28,42.03) 22.51,41.8 22.51,41.5 arc(22.57,41.34) 22.74,41.28 32.89,41.28 34.54,42.93 34.54,45.59 H2.24
LCD_BL_PD12: length 21.5
  Top Layer w0.152: U2.23 2.54,19.05 2.54,14.61 3.17,13.97 6.35,13.97 6.86,13.46 14.99,13.46 15.57,12.88 H1.8
LCD_RST_PC2: length 82.6
  Bottom Layer w0.152: U2.5 2.54,44.45 2.54,49.28 3.05,49.78 4.32,49.78 6.17,47.93 6.17,43.16 23.16,26.16 45.42,26.16 58.75,12.83 H1.42
SDIO_CK_PC12: length 70.5
  Inner1 w0.152: v2(33.15,36.32) 43.32,36.32 arc(43.48,36.26) 43.55,36.09 43.55,35.66 arc(43.78,35.43) 44.01,35.66 44.01,36.09 arc(44.24,36.32) 44.47,36.09 44.47,35.66 arc(44.69,35.43) 44.92,35.66 44.92,36.09 arc(45.15,36.32) 45.38,36.09 45.38,35.68 arc(45.61,35.45) 45.84,35.68 45.84,36.09 arc(45.9,36.26) 46.07,36.32 68.96,36.32 76.71,28.58 v2(76.71,23.88)
  Bottom Layer w0.152: H2.18 29.46,45.75 29.46,40.01 v2(33.15,36.32) ; TF1.5 75.56,22.72 v2(76.71,23.88)
SDIO_CMD_PD2: length 70.5
  Bottom Layer w0.152: R3.1 74.17,28.83 70.99,32 66.99,32 arc(66.83,31.94) 66.76,31.78 66.76,31.6 arc(66.53,31.37) 66.3,31.6 66.3,31.78 arc(66.08,32) 65.85,31.78 65.85,31.6 arc(65.62,31.37) 65.39,31.6 65.39,31.78 arc(65.16,32) 64.93,31.78 64.93,31.6 arc(64.7,31.37) 64.48,31.6 64.48,31.78 arc(64.25,32) 64.02,31.78 64.02,31.6 arc(63.79,31.37) 63.56,31.6 63.56,31.78 arc(63.33,32) 63.1,31.78 63.1,31.6 arc(62.88,31.37) 62.65,31.6 62.65,31.78 arc(62.42,32) 62.19,31.78 62.19,31.6 arc(61.96,31.37) 61.73,31.6 61.73,31.78 arc(61.5,32) 61.28,31.78 61.28,31.6 arc(61.05,31.37) 60.82,31.6 60.82,31.78 arc(60.59,32) 60.36,31.78 60.36,31.6 arc(60.13,31.37) 59.9,31.6 59.9,31.78 arc(59.68,32) 59.45,31.78 59.45,31.6 arc(59.22,31.37) 58.99,31.6 58.99,31.78 arc(58.76,32) 58.53,31.78 58.53,31.6 arc(58.3,31.37) 58.08,31.6 58.08,31.78 arc(57.85,32) 57.62,31.78 57.62,31.6 arc(57.39,31.37) 57.16,31.6 57.16,31.78 arc(56.93,32) 56.7,31.78 56.7,31.6 arc(56.48,31.37) 56.25,31.6 56.25,31.78 arc(56.02,32) 55.79,31.78 55.79,31.6 arc(55.56,31.37) 55.33,31.6 55.33,31.78 arc(55.1,32) 54.87,31.78 54.87,31.6 arc(54.65,31.37) 54.42,31.6 54.42,31.78 arc(54.19,32) 53.96,31.78 53.96,31.6 arc(53.73,31.37) 53.5,31.6 53.5,31.78 arc(53.27,32) 53.05,31.78 53.05,31.66 arc(52.82,31.43) 52.59,31.66 52.59,31.78 arc(52.52,31.94) 52.36,32 37.46,32 34.54,34.93 34.54,45.75 H2.22
SDIO_D0_PC8: length 70.5
  Top Layer w0.152: v2(29.15,33.08) 73.33,33.08 v2(77.47,28.95)
  Bottom Layer w0.152: v2(29.15,33.08) 19.3,42.93 19.3,45.75 H2.10 ; R4.1 v2(77.47,28.95)
SDIO_D1_PC9: length 70.5
  Top Layer w0.152: v2(78.99,28.95) 73.02,34.93 42.18,34.93 arc(42.02,34.99) 41.95,35.15 41.95,35.66 arc(41.72,35.89) 41.49,35.66 41.49,35.15 arc(41.26,34.93) 41.03,35.15 41.03,35.71 arc(40.81,35.94) 40.58,35.71 40.58,35.15 arc(40.51,34.99) 40.35,34.93 v2(29.21,34.93)
  Bottom Layer w0.152: H2.11 20.65,43.48 v2(29.21,34.93) ; R5.1 v2(78.99,28.95)
SDIO_D2_PC10: length 70.5
  Bottom Layer w0.152: R1.1 71.12,28.45 69.85,29.72 57.95,29.72 arc(57.78,29.65) 57.72,29.49 57.72,29.47 arc(57.49,29.24) 57.26,29.47 57.26,29.49 arc(57.03,29.72) 56.8,29.49 56.8,29.31 arc(56.58,29.08) 56.35,29.31 56.35,29.49 arc(56.12,29.72) 55.89,29.49 55.89,29.31 arc(55.66,29.08) 55.43,29.31 55.43,29.49 arc(55.2,29.72) 54.97,29.49 54.97,29.31 arc(54.75,29.08) 54.52,29.31 54.52,29.49 arc(54.29,29.72) 54.06,29.49 54.06,29.31 arc(53.83,29.08) 53.6,29.31 53.6,29.49 arc(53.37,29.72) 53.15,29.49 53.15,29.31 arc(52.92,29.08) 52.69,29.31 52.69,29.49 arc(52.46,29.72) 52.23,29.49 52.23,29.31 arc(52,29.08) 51.77,29.31 51.77,29.49 arc(51.55,29.72) 51.32,29.49 51.32,29.31 arc(51.09,29.08) 50.86,29.31 50.86,29.49 arc(50.63,29.72) 50.4,29.49 50.4,29.31 arc(50.17,29.08) 49.95,29.31 49.95,29.49 arc(49.72,29.72) 49.49,29.49 49.49,29.31 arc(49.26,29.08) 49.03,29.31 49.03,29.49 arc(48.8,29.72) 48.57,29.49 48.57,29.31 arc(48.34,29.08) 48.12,29.31 48.12,29.49 arc(47.89,29.72) 47.66,29.49 47.66,29.31 arc(47.43,29.08) 47.2,29.31 47.2,29.49 arc(46.97,29.72) 46.74,29.49 46.74,29.31 arc(46.52,29.08) 46.29,29.31 46.29,29.49 arc(46.06,29.72) 45.83,29.49 45.83,29.31 arc(45.6,29.08) 45.37,29.31 45.37,29.49 arc(45.31,29.65) 45.14,29.72 36.2,29.72 26.92,38.99 26.92,45.75 H2.16
SDIO_D3_PC11: length 70.5
  Bottom Layer w0.152: R2.1 72.64,28.58 70.36,30.86 46.58,30.86 arc(46.42,30.93) 46.36,31.09 46.36,31.27 arc(46.13,31.5) 45.9,31.27 45.9,30.41 arc(45.67,30.18) 45.44,30.41 45.44,31.32 arc(45.21,31.55) 44.98,31.32 44.98,30.4 arc(44.75,30.18) 44.53,30.4 44.53,31.32 arc(44.3,31.55) 44.07,31.32 44.07,30.4 arc(43.84,30.18) 43.61,30.4 43.61,31.32 arc(43.38,31.55) 43.15,31.32 43.15,30.4 arc(42.93,30.18) 42.7,30.4 42.7,31.32 arc(42.47,31.55) 42.24,31.32 42.24,30.4 arc(42.01,30.18) 41.78,30.4 41.78,31.32 arc(41.55,31.55) 41.33,31.32 41.33,30.4 arc(41.1,30.18) 40.87,30.4 40.87,31.32 arc(40.64,31.55) 40.41,31.32 40.41,31.09 arc(40.34,30.93) 40.18,30.86 36.83,30.86 28.27,39.42 H2.17
SPI2_MISO_PB14: length 26.1
  Inner2 w0.152: U2.29 2.54,13.97 23.14,13.97 H1.16
SPI2_MOSI_PB15: length 19.8
  Bottom Layer w0.152: U2.30 4.19,13.08 11.18,13.08 11.81,12.45 11.81,10.67 12.32,10.16 19.33,10.16 H1.11
SPI2_NSS_PB12: length 31.2
  Inner2 w0.152: U2.33 2.54,6.35 4.44,6.35 5.08,6.99 5.08,8.53 5.97,9.42 5.97,12.47 6.96,13.46 20.7,13.46 21.97,12.19 21.97,10.06 H1.13
SPI2_SCK_PB13: length 24.7
  Inner2 w0.152: U2.34 5.71,9.53 5.71,12.57 6.86,13.72 20.85,13.72 H1.14
TF_CD_PC7: length 79.2
  Bottom Layer w0.152: TF1.9 79.96,20.9 77.85,18.8 69.98,18.8 68.83,19.94 68.83,26.54 67.44,27.94 33.15,27.94 18.11,42.98 H2.9
TP_INT_PB11: length 32.7
  Inner1 w0.152: v2(9.27,14.61) 6.1,11.43 2.54,11.43 U2.31
  Inner2 w0.152: v2(9.27,14.61) 25.15,14.61 26.92,12.83 26.92,10.03 H1.15
USART2_RX_PA3: length 69
  Top Layer w0.152: 80.02,44.83 78.23,44.83 77.47,44.07 77.47,33.53 83.18,27.81 83.18,18.54 81.28,16.64 57.15,16.64 54.86,14.35 54.86,10.67 54.36,10.16 52.45,10.16 H1.35
USART2_TX_PA2: length 65.6
  Top Layer w0.152: H1.38 53.67,14.3 56.64,17.27 80.9,17.27 82.42,18.8 82.42,27.43 76.71,33.15 76.71,44.45 78.36,46.1 80.02,46.1
$1N3517: length 3.4
  Bottom Layer w0.152: R5.2 78.86,25.27 TF1.8
$1N3521: length 3.5
  Bottom Layer w0.152: TF1.7 77.76,25.12 R4.2
$1N3530: length 3.7
  Bottom Layer w0.152: R3.2 74.17,24.26 73.36,23.45 TF1.3
$1N3535: length 3.6
  Bottom Layer w0.152: R2.2 72.77,25.28 72.77,24.26 72.26,23.74 TF1.2
$1N3540: length 3.4
  Bottom Layer w0.152: TF1.1 71.16,25.37 R1.2
$1N3834: length 3.6
  Top Layer w0.508: 80.02,41.02 83.53,41.02 LED1.2
$1N3899: length 2.1
  Top Layer w0.508: LED1.1 83.57,42.59 83.57,44.67

## Copper pours and planes (outline as drawn; the poured copper is in the pictures)
3V3 on Inner1: 0,55.88 0,1.27 0,1.27 0,0 1.27,0 6.7,0 6.7,1.24 6.73,1.27 6.73,7.37 95.12,7.37 95.12,3.66 96.37,3.66 96.39,3.68 99.82,3.68 99.82,52.07 99.95,52.2 95.15,52.2 95.15,51.08 95.12,51.05 95.12,48.64 95,48.51 95,48.41 6.73,48.41 6.73,55.75 6.6,55.88
GND on Inner2: 0,55.88 0,1.27 0,1.27 0,0 1.27,0 6.7,0 6.7,1.24 6.73,1.27 6.73,7.37 95.12,7.37 95.12,3.66 96.37,3.66 96.39,3.68 99.82,3.68 99.82,52.07 99.95,52.2 95.15,52.2 95.15,51.08 95.12,51.05 95.12,48.64 95,48.51 95,48.41 6.73,48.41 6.73,55.75 6.6,55.88

Small or netless copper shapes (teardrops, artwork), in the pictures only: 74 on Top Layer, 60 on Bottom Layer, 12 on Inner1, 11 on Inner2
